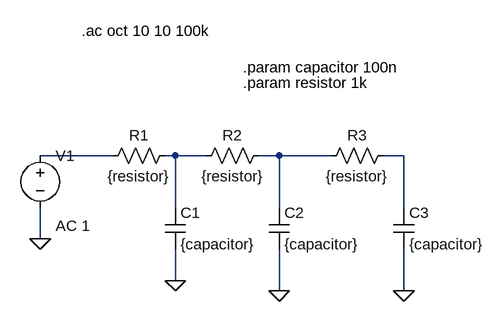
[diagram p0: schematic Draft6.asc]
Draft6.asc, the LTspice schematic file:
Version 4
SHEET 1 880 680
WIRE 224 80 112 80
WIRE 320 80 304 80
WIRE 368 80 320 80
WIRE 480 80 448 80
WIRE 560 80 480 80
WIRE 672 80 640 80
WIRE 320 160 320 80
WIRE 480 160 480 80
WIRE 672 160 672 80
WIRE 112 208 112 160
WIRE 320 272 320 224
WIRE 480 288 480 224
WIRE 672 288 672 224
FLAG 112 208 0
FLAG 320 272 0
FLAG 480 288 0
FLAG 672 288 0
SYMBOL voltage 112 64 R0
WINDOW 123 24 124 Left 2
WINDOW 39 0 0 Left 0
SYMATTR InstName V1
SYMATTR Value ""
SYMATTR Value2 AC 1
SYMBOL cap 304 160 R0
SYMATTR InstName C1
SYMATTR Value {capacitor}
SYMBOL cap 464 160 R0
SYMATTR InstName C2
SYMATTR Value {capacitor}
SYMBOL cap 656 160 R0
SYMATTR InstName C3
SYMATTR Value {capacitor}
SYMBOL res 320 64 R90
WINDOW 0 0 56 VBottom 2
WINDOW 3 32 56 VTop 2
SYMATTR InstName R1
SYMATTR Value {resistor}
SYMBOL res 464 64 R90
WINDOW 0 0 56 VBottom 2
WINDOW 3 32 56 VTop 2
SYMATTR InstName R2
SYMATTR Value {resistor}
SYMBOL res 656 64 R90
WINDOW 0 0 56 VBottom 2
WINDOW 3 32 56 VTop 2
SYMATTR InstName R3
SYMATTR Value {resistor}
TEXT 424 -32 Left 2 !.param resistor 1k
TEXT 424 -56 Left 2 !.param capacitor 100n
TEXT 176 -112 Left 2 !.ac oct 10 10 100k

The netlist it stands for:
* Draft6.asc
V1 N001 0 AC 1
C1 N002 0 {capacitor}
C2 N003 0 {capacitor}
C3 N004 0 {capacitor}
R1 N002 N001 {resistor}
R2 N003 N002 {resistor}
R3 N004 N003 {resistor}
.param resistor 1k
.param capacitor 100n
.ac oct 10 10 100k
.backanno
.end